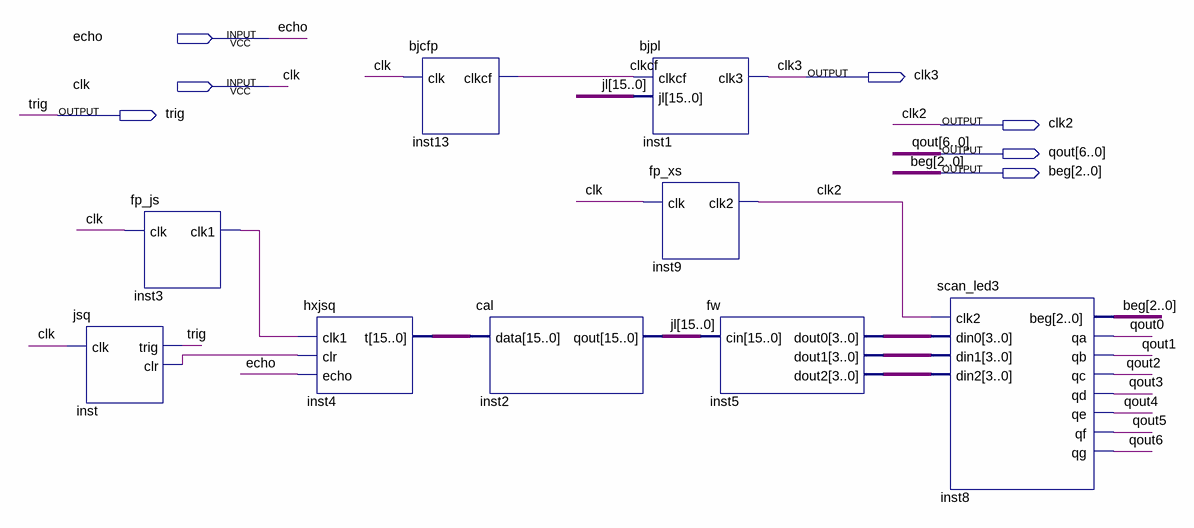
[diagram p0: schematic sheet]
// Quartus schematic dc.bdf as structural Verilog: 9 symbols, 7 pins
module dc (
  input  echo,
  input  clk,
  output clk3,
  output trig,
  output clk2,
  output [6:0] qout,
  output [2:0] beg
);

  wire clkcf, inst3_clk1, inst_clr;
  wire [3:0] inst5_dout0, inst5_dout1, inst5_dout2;
  wire [15:0] inst4_t, jl;

  jsq inst (.clk(clk), .trig(trig), .clr(inst_clr));
  fp_js inst3 (.clk(clk), .clk1(inst3_clk1));
  hxjsq inst4 (.clk1(inst3_clk1), .clr(inst_clr), .echo(echo), .t(inst4_t));
  bjcfp inst13 (.clk(clk), .clkcf(clkcf));
  cal inst2 (.data(inst4_t), .qout(jl));
  bjpl inst1 (.clkcf(clkcf), .jl(jl), .clk3(clk3));
  fp_xs inst9 (.clk(clk), .clk2(clk2));
  fw inst5 (.cin(jl), .dout0(inst5_dout0), .dout1(inst5_dout1), .dout2(inst5_dout2));
  scan_led3 inst8 (
    .clk2(clk2), .din0(inst5_dout0), .din1(inst5_dout1), .din2(inst5_dout2), .beg(beg), .qa(qout[0]),
    .qb(qout[1]), .qc(qout[2]), .qd(qout[3]), .qe(qout[4]), .qf(qout[5]), .qg(qout[6]));
endmodule
